# Altium project CC1200_PCB.PrjPcb
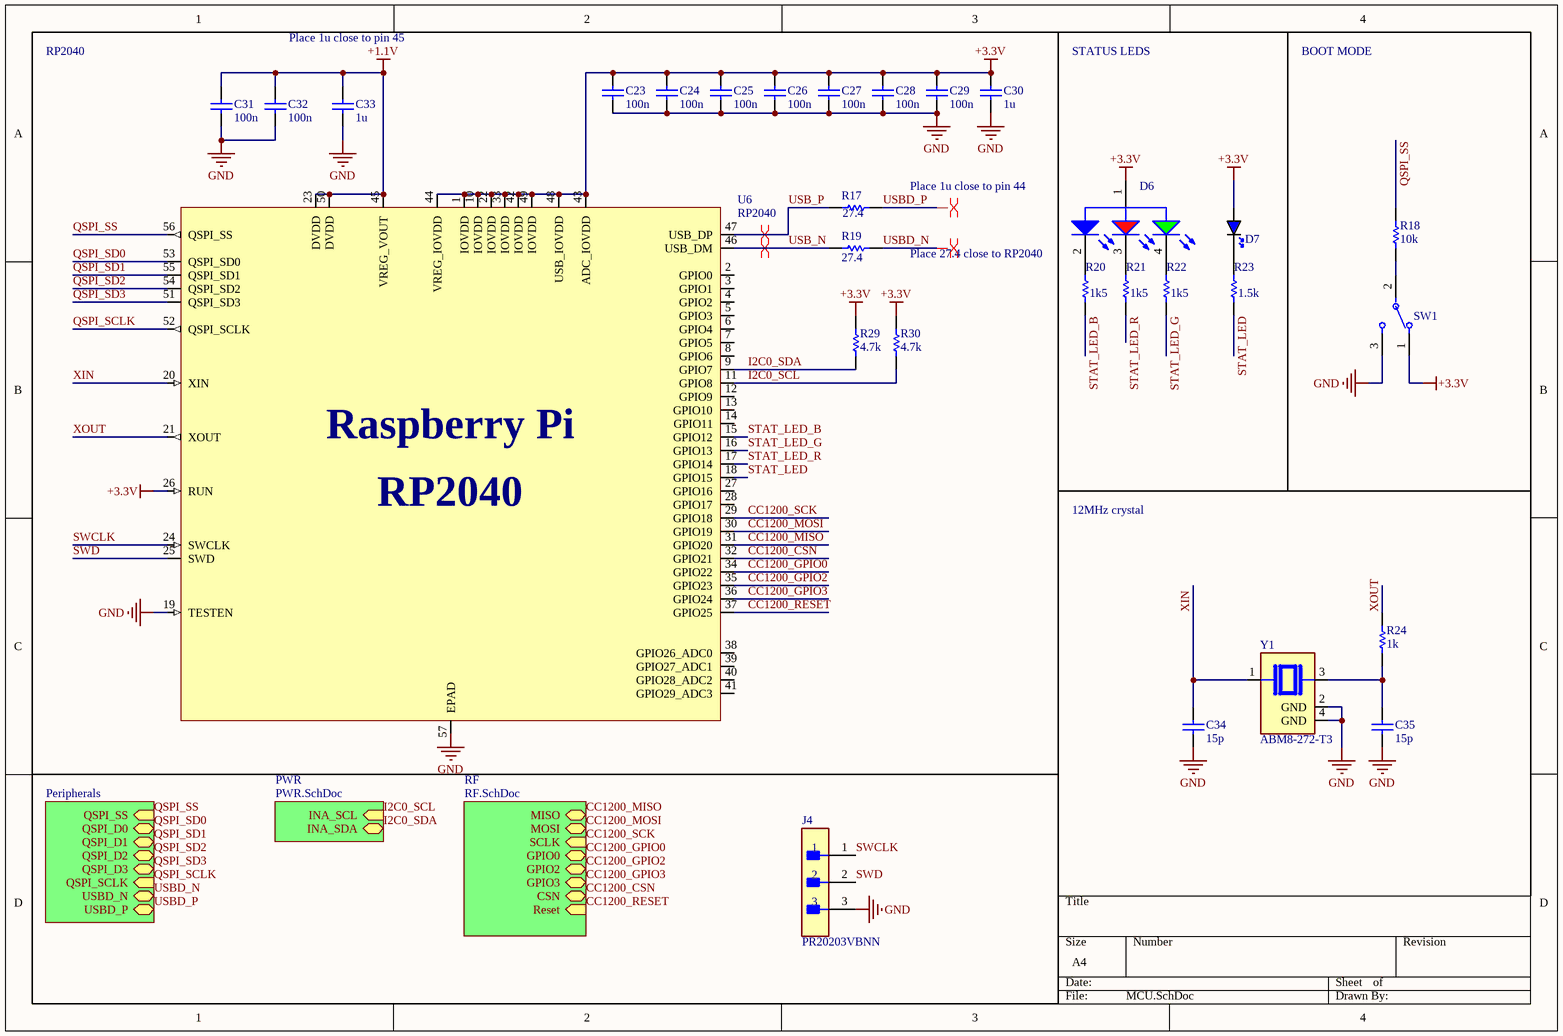
[diagram p0: MCU.SchDoc]
2 sheets, 69 parts. Net scope: hierarchical (ports join the sheet entries above them; power ports are global).
Board file: CC1200_PCB.PcbDoc
Sheets:
  MCU.SchDoc
    RF = RF.SchDoc

## Sheet MCU.SchDoc
size A4; SheetNumber: 1; SheetTotal: 4

### Parts
C23  value 100n  [RES_0805]  (hidden comment: Capacitor)
C24  value 100n  [RES_0805]  (hidden comment: Capacitor)
C25  value 100n  [RES_0805]  (hidden comment: Capacitor)
C26  value 100n  [RES_0805]  (hidden comment: Capacitor)
C27  value 100n  [RES_0805]  (hidden comment: Capacitor)
C28  value 100n  [RES_0805]  (hidden comment: Capacitor)
C29  value 100n  [RES_0805]  (hidden comment: Capacitor)
C30  value 1u  [RES_0805]  (hidden comment: Capacitor)
C31  value 100n  [RES_0805]  (hidden comment: Capacitor)
C32  value 100n  [RES_0805]  (hidden comment: Capacitor)
C33  value 1u  [RES_0805]  (hidden comment: Capacitor)
C34  value 15p  [RES_0805]  (hidden comment: Capacitor)
C35  value 15p  [RES_0805]  (hidden comment: Capacitor)
D6  150141M173100  [WL-SFTW_3528_150141M173100]  (value not drawn)
D7  BLUE  [LED_0805_BLUE]  (value not drawn)
J4  PR20203VBNN  [FP-PR20203VBNN-MFG]
R17  value 27.4  [RES_0805]  (hidden comment: Resistor)
R18  value 10k  [RES_0603]  (hidden comment: Resistor)
R19  value 27.4  [RES_0805]  (hidden comment: Resistor)
R20  value 1k5  [RES_0805]  (hidden comment: Resistor)
R21  value 1k5  [RES_0805]  (hidden comment: Resistor)
R22  value 1k5  [RES_0805]  (hidden comment: Resistor)
R23  value 1.5k  [RES_0805]  (hidden comment: Resistor)
R24  value 1k  [RES_0805]  (hidden comment: Resistor)
R29  value 4.7k  [RES_0805]  (hidden comment: Resistor)
R30  value 4.7k  [RES_0805]  (hidden comment: Resistor)
SW1  JS102011SAQN  [FP-JS102011SAQN-MFG]  (value not drawn)
U6  RP2040  [QFN-56-EP]
Y1  ABM8-272-T3  [XTAL_ABM8-272-T3]

### Sub-sheets
Peripherals = Peripherals.SchDoc (file not in this document): QSPI_SS (in), QSPI_D0 (bidir), QSPI_D1 (bidir), QSPI_D2 (bidir), QSPI_SCLK (in), QSPI_D3 (bidir), USBD_N (bidir), USBD_P (bidir)
PWR = PWR.SchDoc (file not in this document): INA_SCL (in), INA_SDA (bidir)
RF = RF.SchDoc: MISO (bidir), MOSI (bidir), SCLK (in), GPIO0 (bidir), GPIO2 (bidir), GPIO3 (bidir), CSN (bidir), Reset (in)

### Nets
+1.1V: C31.1 C32.1 C33.1 U6.23(DVDD) U6.45(VREG_VOUT) U6.50(DVDD)
+3.3V: C23.1 C24.1 C25.1 C26.1 C27.1 C28.1 C29.1 C30.1 D6.1(A) D7.A R29.2 R30.2 SW1.1 U6.1(IOVDD) U6.10(IOVDD) U6.22(IOVDD) U6.26(RUN) U6.33(IOVDD) U6.42(IOVDD) U6.43(ADC_IOVDD) U6.44(VREG_IOVDD) U6.48(USB_IOVDD) U6.49(IOVDD)
GND: C23.2 C24.2 C25.2 C26.2 C27.2 C28.2 C29.2 C30.2 C31.2 C32.2 C33.2 C34.2 C35.2 J4.3 SW1.3 U6.19(TESTEN) U6.57(EPAD) Y1.2(GND) Y1.4(GND)
CC1200_CSN: U6.32(GPIO21) ; sheet RF/CSN
CC1200_GPIO0: U6.34(GPIO22) ; sheet RF/GPIO0
CC1200_GPIO2: U6.35(GPIO23) ; sheet RF/GPIO2
CC1200_GPIO3: U6.36(GPIO24) ; sheet RF/GPIO3
CC1200_MISO: U6.31(GPIO20) ; sheet RF/MISO
CC1200_MOSI: U6.30(GPIO19) ; sheet RF/MOSI
CC1200_RESET: U6.37(GPIO25) ; sheet RF/Reset
CC1200_SCK: U6.29(GPIO18) ; sheet RF/SCLK
I2C0_SCL: R30.1 U6.11(GPIO8) ; sheet PWR/INA_SCL
I2C0_SDA: R29.1 U6.9(GPIO7) ; sheet PWR/INA_SDA
QSPI_SCLK: U6.52(QSPI_SCLK) ; sheet Peripherals/QSPI_SCLK
QSPI_SD0: U6.53(QSPI_SD0) ; sheet Peripherals/QSPI_D0
QSPI_SD1: U6.55(QSPI_SD1) ; sheet Peripherals/QSPI_D1
QSPI_SD2: U6.54(QSPI_SD2) ; sheet Peripherals/QSPI_D2
QSPI_SD3: U6.51(QSPI_SD3) ; sheet Peripherals/QSPI_D3
QSPI_SS: R18.1 U6.56(QSPI_SS) ; sheet Peripherals/QSPI_SS
STAT_LED: R23.2 U6.18(GPIO15)
STAT_LED_B: R20.2 U6.15(GPIO12)
STAT_LED_G: R22.2 U6.16(GPIO13)
STAT_LED_R: R21.2 U6.17(GPIO14)
SWCLK: J4.1 U6.24(SWCLK)
SWD: J4.2 U6.25(SWD)
USB_N: R19.1 U6.46(USB_DM)
USB_P: R17.1 U6.47(USB_DP)
USBD_N: R19.2 ; sheet Peripherals/USBD_N
USBD_P: R17.2 ; sheet Peripherals/USBD_P
XIN: C34.1 U6.20(XIN) Y1.1
XOUT: R24.2 U6.21(XOUT)
NetC35_1: C35.1 R24.1 Y1.3
NetD6_2: D6.2(K) R20.1
NetD6_3: D6.3(K) R21.1
NetD6_4: D6.4(K) R22.1
NetD7_K: D7.K R23.1
NetR18_2: R18.2 SW1.2(C)

Not connected (* = marked no-connect by the designer): U6 2(GPIO0) 3(GPIO1) 4(GPIO2) 5(GPIO3) 6(GPIO4) 7(GPIO5) 8(GPIO6) 12(GPIO9) 13(GPIO10) 14(GPIO11) 27(GPIO16) 28(GPIO17) 38(GPIO26_ADC0) 39(GPIO27_ADC1) 40(GPIO28_ADC2) 41(GPIO29_ADC3)

### Layout directives
differential pair: USB_N, USB_P, USBD_N, USBD_P

### Notes on the sheet
- Place 1u close to pin 45
- RP2040
- STATUS LEDS
- BOOT MODE
- Place 1u close to pin 44
- Place 27.4 close to RP2040
- 12MHz crystal

### Library data of the parts
C23-C35 = Capacitor: SimulationGenericComponent: True
D6 = CMP-1431-00001-2: NexarPartId: 29717795; Forward Current: 100mA; Peak Wavelength: 465nm; Viewing Angle: 120°; Color: Green, Red; Max Reverse Voltage (DC): 5V; Forward Voltage: 3.2V; Dominant Wavelength: 520nm; Test Current: 20mA; Power Dissipation: 72mW; Wavelength: 470nm; Lens Style: Clear, Round; Luminous Intensity: 230mcd; Case/Package: 1411; Packaging: Tape and Reel; Case Code (Metric): 3528; Min Operating Temperature: -40°C; Length: 3.5mm; Number of Pins: 4; Width: 2.8mm; Max Operating Temperature: 85°C; Case Code (Imperial): 1411; Height: 1.9mm; REACH SVHC: Unknown; Mount: Surface Mount; RoHS: Compliant
D7 = LED_0805_BLUE: LED 0805 BLUE SMD; Manufacturer: *; Manufacturer Part Number: *; Distributor Link: *; LCSC: *
J4 = CMP-77940-000002-1: CONN HEADER VERT 3POS 2.54MM; Manufacturer: Metz Connect; Conn Orientation: Straight; Current Rating: 3A; Number Of Contacts: 3; Conn Gender: Male; Temperature: -40°C to +105°C; Pitch: 2.54mm; Device Class L1: Connectors; Digikey Description: CONN HEADER VERT 3POS 2.54MM; ComponentLink2URL: https://datasheet.octopart.com/PR20203VBNN-Metz-Connect-datasheet-101610322.pdf; Height: 8.6mm; Temperature Range High: +105°C; Manufacturer Part Number: PR20203VBNN; Number Of Rows: 1; Octopart: https://octopart.com/pr20203vbnn-metz+connect-87667116; Device Class L3: unset; ComponentLink2Description: Datasheet; Device Class L2: Headers and Wire Housings; Temperature Range Low: -40°C; Automotive: No; Contact Material: Gold,Nickel; Category: Conn; Lead Free: Yes; RoHS: TRUE; Package: PR20203VBNN
R17-R24 R29 R30 = Resistor: TC1: 0; SimulationGenericComponent: True; TC2: 0
SW1 = CMP-2000-06501-2: SWITCH SLIDE SPDT 300MA 6V; Switch Function: On-On; Illumination Type: Non-Illuminated; Switch Travel: 2mm; Contact Resistance: 70mR; Actuator Material: Nylon; Electrical Life: 5000Cycles; Actuator Type: Standard; Max Operating Temperature: 85°C; Housing Material: Nylon; Radiation Hardening: No; Max Voltage Rating (DC): 6V; Package Quantity: 1; Case/Package: 100; Actuator Length: 2mm; Min Operating Temperature: -40°C; Contact Current Rating: 300mA; REACH SVHC: No SVHC; Throw Configuration: SPDT; Packaging: Tape and Reel; Contact Material: Copper Alloy; Max Current Rating: 300mA; Current Rating: 300mA; Mount: Surface Mount; Lead Free: Lead Free; Termination: Gull Wing; Voltage Rating (DC): 6V; Length: 9mm; Orientation: Right Angle; Contact Plating: Silver
U6 = RP2040: 32-Bit Dual-Core ARM Cortex-M0+ Microcontroller; Manufacturer: Raspberry Pi; Manufacturer Part Number: RP2040
Y1 = ABM8-272-T3: 12 MHz Â±30ppm Crystal 10pF 50 Ohms 4-SMD, No Lead; MF: ABRACON; SnapEDA_Link: https://www.snapeda.com/parts/ABM8-272-T3/Abracon/view-part/?ref=snap; Package: NON-STANDARD-4 Abracon; Value: *; MP: ABM8-272-T3; Check_prices: https://www.snapeda.com/parts/ABM8-272-T3/Abracon/view-part/?ref=eda

## Sheet RF.SchDoc
size A4; SheetNumber: 4; SheetTotal: 4
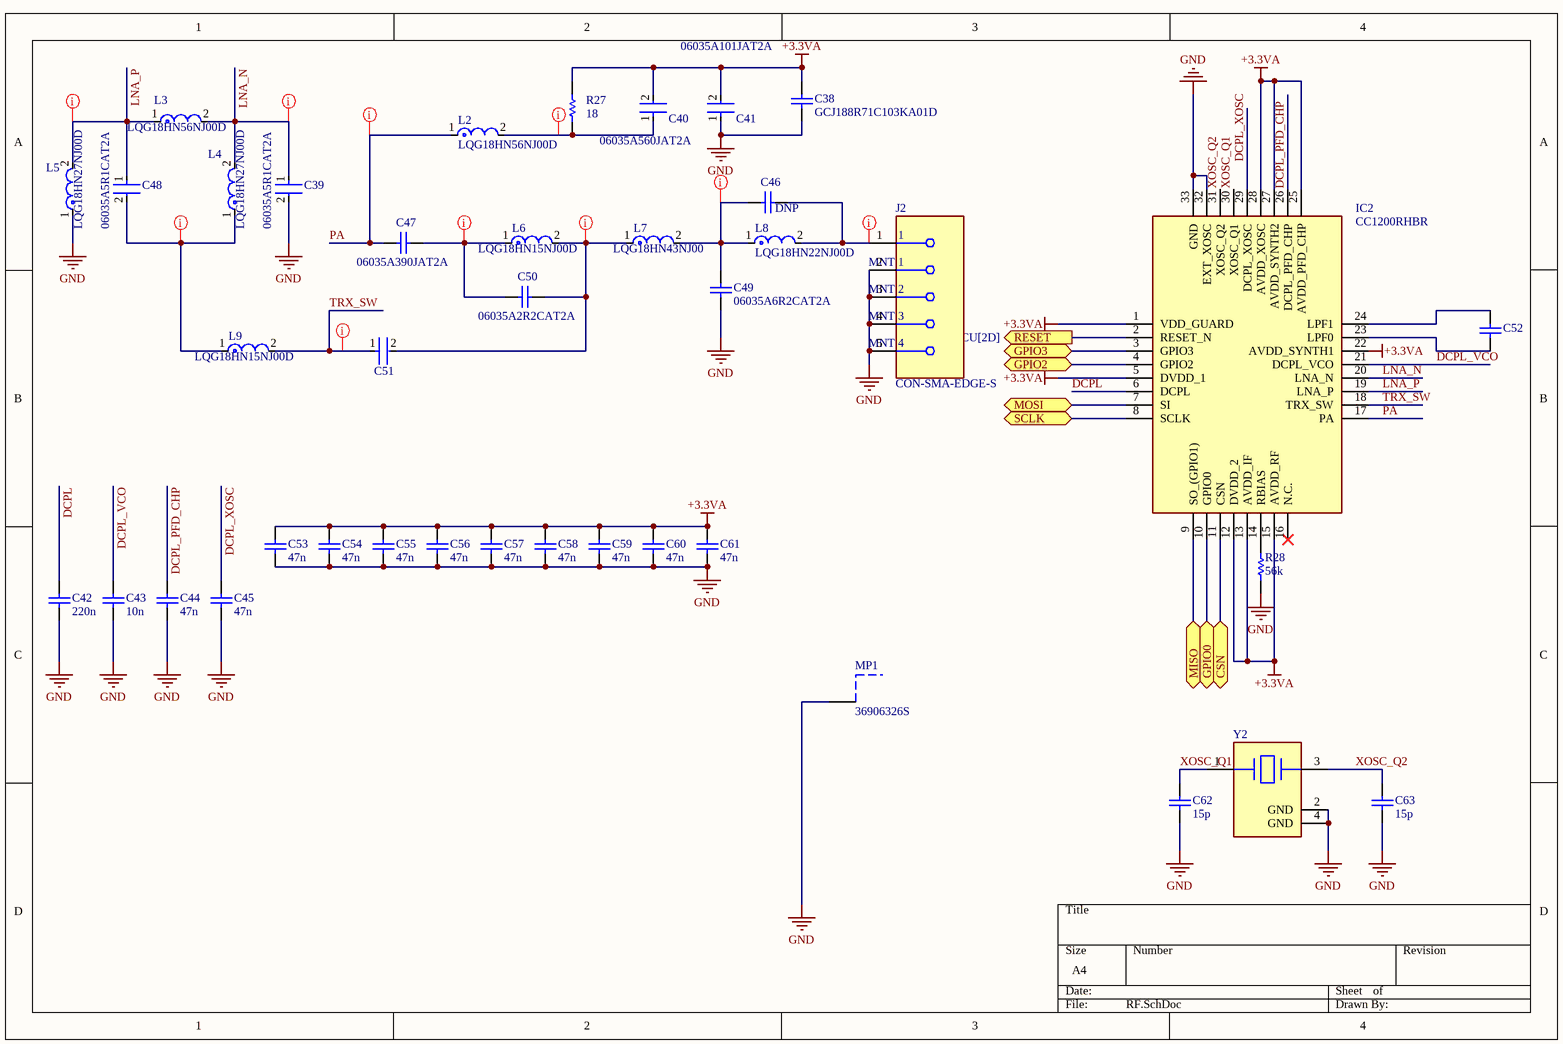
[diagram p1: RF.SchDoc]

### Parts
C38  GCJ188R71C103KA01D  [CAPC1608X90X35LL10T15]
C39  06035A5R1CAT2A  [FP-GCM188-0_1-IPC_A]
C40  06035A560JAT2A  [FP-GCM188-0_1-IPC_A]
C41  06035A101JAT2A  [FP-GCM188-0_1-IPC_A]
C42  value 220n  [RES_0805]  (hidden comment: Capacitor)
C43  value 10n  [RES_0805]  (hidden comment: Capacitor)
C44  value 47n  [RES_0805]  (hidden comment: Capacitor)
C45  value 47n  [RES_0805]  (hidden comment: Capacitor)
C46  DNP  [CAPC1608X90X35LL15T15]
C47  06035A390JAT2A  [CAPC1608X90X35LL15T15]
C48  06035A5R1CAT2A  [FP-GCM188-0_1-IPC_A]
C49  06035A6R2CAT2A  [CAPC1608X90X35LL15T15]
C50  06035A2R2CAT2A  [CAPC1608X90X35LL15T15]
C51  06035A5R1CAT2A  [FP-GCM188-0_1-IPC_A]  (value not drawn)
C52  GCM188R71H152KA37D  [CAPC1608X90X35LL10T15]  (value not drawn)
C53  value 47n  [RES_0805]  (hidden comment: Capacitor)
C54  value 47n  [RES_0805]  (hidden comment: Capacitor)
C55  value 47n  [RES_0805]  (hidden comment: Capacitor)
C56  value 47n  [RES_0805]  (hidden comment: Capacitor)
C57  value 47n  [RES_0805]  (hidden comment: Capacitor)
C58  value 47n  [RES_0805]  (hidden comment: Capacitor)
C59  value 47n  [RES_0805]  (hidden comment: Capacitor)
C60  value 47n  [RES_0805]  (hidden comment: Capacitor)
C61  value 47n  [RES_0805]  (hidden comment: Capacitor)
C62  value 15p  [RES_0805]  (hidden comment: Capacitor)
C63  value 15p  [RES_0805]  (hidden comment: Capacitor)
IC2  CC1200RHBR  [QFN50P500X500X100-33N-D]
J2  CON-SMA-EDGE-S  [FP-CON-SMA-EDGE-S-MFG]
L2  LQG18HN56NJ00D  [FP-LQG18HH_00-IPC_A]
L3  LQG18HN56NJ00D  [FP-LQG18HH_00-IPC_A]
L4  LQG18HN27NJ00D  [FP-LQG18HH_00-MFG]
L5  LQG18HN27NJ00D  [FP-LQG18HH_00-MFG]
L6  LQG18HN15NJ00D  [FP-LQG18HH_00-IPC_C]
L7  LQG18HN43NJ00  [FP-LQG18HH_00-IPC_C]
L8  LQG18HN22NJ00D  [FP-LQG18HH_00-IPC_C]
L9  LQG18HN15NJ00D  [FP-LQG18HH_00-IPC_C]
MP1  36906326S  [36906326S]
R27  value 18  [RES_0805]  (hidden comment: Resistor)
R28  value 56k  [RES_0805]  (hidden comment: Resistor)
Y2  NX3225SA-40.000MHZ-STD-CSR-1 NDK  [FP-ABM8G-MFG]  (value not drawn)

### Ports
CSN (bidir, see MCU[2D]), GPIO0 (bidir, see MCU[2D]), GPIO2 (bidir, see MCU[2D]), GPIO3 (bidir, see MCU[2D]), MISO (bidir, see MCU[2D]), MOSI (bidir, see MCU[2D]), RESET (out, see MCU[2D]), SCLK (bidir, see MCU[2D])

### Nets
+3.3VA: C38.2 C40.2 C41.2 C53.1 C54.1 C55.1 C56.1 C57.1 C58.1 C59.1 C60.1 C61.1 IC2.1(VDD_GUARD) IC2.5(DVDD_1) IC2.12(DVDD_2) IC2.13(AVDD_IF) IC2.15(AVDD_RF) IC2.22(AVDD_SYNTH1) IC2.25(AVDD_PFD_CHP) IC2.27(AVDD_SYNTH2) IC2.28(AVDD_XOSC) R27.1
GND: C38.1 C39.2 C41.1 C42.2 C43.2 C44.2 C45.2 C49.1 C53.2 C54.2 C55.2 C56.2 C57.2 C58.2 C59.2 C60.2 C61.2 C62.2 C63.2 IC2.32(EXT_XOSC) IC2.33(GND) J2.2(MNT_1) J2.3(MNT_2) J2.4(MNT_3) J2.5(MNT_4) L5.1 MP1.1 R28.2 Y2.2(GND) Y2.4(GND)
CC1200_CSN: IC2.11(CSN) ; port CSN
CC1200_GPIO0: IC2.10(GPIO0) ; port GPIO0
CC1200_GPIO2: IC2.4(GPIO2) ; port GPIO2
CC1200_GPIO3: IC2.3(GPIO3) ; port GPIO3
CC1200_MISO: IC2.9(SO_(GPIO1)) ; port MISO
CC1200_MOSI: IC2.7(SI) ; port MOSI
CC1200_RESET: IC2.2(RESET_N) ; port RESET
CC1200_SCK: IC2.8(SCLK) ; port SCLK
DCPL: C42.1 IC2.6(DCPL)
DCPL_PFD_CHP: C44.1 IC2.26(DCPL_PFD_CHP)
DCPL_VCO: C43.1 IC2.21(DCPL_VCO)
DCPL_XOSC: C45.1 IC2.29(DCPL_XOSC)
LNA_N: C39.1 IC2.20(LNA_N) L3.2 L4.2
LNA_P: C48.1 IC2.19(LNA_P) L3.1 L5.2
PA: C47.2 IC2.17(PA) L2.1
TRX_SW: C51.1 IC2.18(TRX_SW) L9.2
XOSC_Q1: C62.1 IC2.30(XOSC_Q1) Y2.1
XOSC_Q2: C63.1 IC2.31(XOSC_Q2) Y2.3
NetC40_1: C40.1 L2.2 R27.2
NetC46_1: C46.1 J2.1 L8.2
NetC46_2: C46.2 C49.2 L7.2 L8.1
NetC47_1: C47.1 C50.2 L6.1
NetC48_2: C48.2 L4.1 L9.1
NetC50_1: C50.1 C51.2 L6.2 L7.1
NetC52_1: C52.1 IC2.23(LPF0)
NetC52_2: C52.2 IC2.24(LPF1)
NetIC2_14: IC2.14(RBIAS) R28.1

Not connected (* = marked no-connect by the designer): IC2 16(N.C.)*

### Layout directives
net class 50ohm: LNA_N, LNA_P, NetC40_1, NetC46_1, NetC46_2, NetC47_1, NetC48_2, NetC50_1, PA, TRX_SW

### Library data of the parts
C38 = CMP-2000-06338-1: Cap Ceramic 0.01uF 16V X7R 10% Pad SMD 0603 Soft Termination 125C Automotive T/R; Manufacturer: Murata; Capacitance: 10nF; Mounting Technology: SurfaceMount; Tolerance (%): ±10%; Case Size/Dimension: 0603; Datasheet URL: http://search.murata.co.jp/Ceramy/image/img/A01X/G101/ENG/GRM188R71C103KA01-01.pdf; Rated Voltage: 16V; Datasheet Version: 02/2016; Dielectric: X7R; Manufacturer URL: http://www.murata.com/; Package Reference: 0603; Package Description: 2-Pin Surface Mount Device, Body 1.6 x 0.8 mm
C39 C48 C51 = CMP-06035-052280-1: 0603 5.1 pF 50 V ±0.25 pF Tolerance C0G/NP0 Multilayer Ceramic Capacitor
C40 = CMP-06035-052280-1: 0603 56 pF 50 V ±5% Tolerance C0G/NP0 Surface Mount Multilayer Ceramic Capacitor
C41 = CMP-06035-052280-1: 0603 100 pF 50 V ±5% Tolerance C0G/NP0 SMT Multilayer Ceramic Capacitor
C42-C45 C53-C63 = Capacitor: SimulationGenericComponent: True
C46 C47 = CMP-2006-04354-1: Part Number: 06035A6R2CAT2A; Manufacturer: AVX Interconnect / Elco
C49 = CMP-2006-04354-1: Manufacturer: AVX Interconnect / Elco; Part Number: 06035A6R2CAT2A
C50 = CMP-2006-04354-1: 0603 2.2 pF 50 V ±0.25 pF Tolerance C0G/NP0 SMT Multilayer Ceramic Capacitor; Part Number: 06035A6R2CAT2A; Manufacturer: AVX Interconnect / Elco
C52 = CMP-2006-02377-1: Manufacturer: Murata; Part Number: GCM188R71H152KA37D
IC2 = CC1200RHBR: Integrated Circuit; Manufacturer_Name: Texas Instruments; Datasheet Link: http://www.ti.com/lit/gpn/cc1200; Height: 1mm; Manufacturer_Part_Number: CC1200RHBR; Mouser Part Number: 595-CC1200RHBR; Mouser Price/Stock: https://www.mouser.co.uk/ProductDetail/Texas-Instruments/CC1200RHBR?qs=R6c3TimDHSkfQr3ZZbsbuA%3D%3D; Arrow Part Number: CC1200RHBR; Arrow Price/Stock: https://www.arrow.com/en/products/cc1200rhbr/texas-instruments
J2 = CMP-204357-000001-1: CONN SMA JACK STR EDGE MNT; Manufacturer: RF Solutions Ltd.; Impedance: 50Ω; Conn Orientation: Right Angle; Is Female: yes; Number Of Contacts: 1; Frequency: 18GHz; Shielding: true; Category: Conn; ComponentLink2URL: https://www.rfsolutions.co.uk/downloads/1498648656DS-CON-EDGE-SMA-4.pdf; Octopart: https://octopart.com/con-sma-edge-s-rf+solutions-70967450; Package: CONN_JACK; Manufacturer Part Number: CON-SMA-EDGE-S; Height: 6.35mm; Device Class L1: Connectors; Footprint Url: https://forum.upverter.com/uploads/default/original/3X/b/e/be75b907af57498775929d6d9099689c472e0307.pdf; Contact Material: Gold; ComponentLink2Description: Datasheet; Device Class L2: RF / Coaxial Connectors; RoHS: TRUE; Device Class L3: unset; Digikey Description: CONN SMA JACK STR EDGE MNT; Lead Free: Yes; Automotive: No
L2 L3 = CMP-06042-002204-1: Multilayer type RF Inductor 56nH ±5% 0.75Ω 400mA 0603; DC Current: 300mA; DC Resistance (DCR): 750mR; Self Resonant Frequency: 1.1GHz; Test Frequency: 100MHz; Shielding: Unshielded; Q Factor: 12; Core Material: Air; Width: 0.031inch; Case Code (Metric): 1608; Inductance: 56nH; Mount: Surface Mount; Depth: 0.95mm; Max DC Current: 300mA; Case/Package: 0603; Length: 1.75mm; Case Code (Imperial): 0603; Military Standard: Not; Min Operating Temperature: -40°C; Lead Free: Lead Free; Packaging: Tape and Reel; Radiation Hardening: No; Max Operating Temperature: 85°C; Termination: SMD/SMT; Tolerance: 5%; Current Rating: 300mA; Package Quantity: 1; Height: 0.031inch
L4 L5 = CMP-06042-005497-1: Multilayer type RF Inductor 27nH ±5% 0.54Ω 500mA 0603; Q Factor: 12; Shielding: Unshielded; Max DC Current: 300mA; Self Resonant Frequency: 2GHz; Test Frequency: 100MHz; Core Material: Air; DC Resistance (DCR): 550mR; Min Operating Temperature: -55°C; Max Operating Temperature: 85°C; Tolerance: 5%; Depth: 0.95mm; Case Code (Imperial): 0603; Package Quantity: 4000; Lead Free: Lead Free; Height: 0.8mm; Radiation Hardening: No; Case/Package: 0603; Mount: Surface Mount; DC Current: 300mA; Length: 0.063inch; Inductance Tolerance: 5%; Military Standard: Not; Termination: SMD/SMT; Packaging: Tape and Reel; Current Rating: 300mA; Inductance: 27nH; Case Code (Metric): 1608; Width: 0.8mm; REACH SVHC: No SVHC; Height - Seated (Max): 0.037inch
L6 L9 = CMP-06042-008636-1: Multilayer type RF Inductor 15nH ±5% 0.35Ω 600mA 0603; Q Factor: 12; Current Rating: 350mA; Core Material: Air; Shielding: Unshielded; Test Frequency: 100MHz; Self Resonant Frequency: 2.8GHz; DC Resistance (DCR): 400mR; Case Code (Imperial): 0603; Width: 0.031inch; Inductance: 15nH; REACH SVHC: No SVHC; Min Operating Temperature: -40°C; Mount: Surface Mount; Height: 0.031inch; Max Operating Temperature: 85°C; DC Current: 350mA; Lead Free: Lead Free; Depth: 0.95mm; Package Quantity: 4000; Radiation Hardening: No; Case Code (Metric): 1608; Termination: SMD/SMT; Inductance Tolerance: 5%; Military Standard: Not; Length: 0.063inch; Packaging: Tape and Reel; Case/Package: 0603; Max DC Current: 350mA; Tolerance: 5%
L7 = CMP-06042-008636-1: Multilayer type RF Inductor 43nH ±5%0603; Q Factor: 12; Current Rating: 350mA; Inductance: 15nH; Core Material: Air; Shielding: Unshielded; Test Frequency: 100MHz; Self Resonant Frequency: 2.8GHz; DC Resistance (DCR): 400mR; Inductance Tolerance: 5%; Case Code (Imperial): 0603; Width: 0.031inch; REACH SVHC: No SVHC; Min Operating Temperature: -40°C; Mount: Surface Mount; Height: 0.031inch; Max Operating Temperature: 85°C; DC Current: 350mA; Lead Free: Lead Free; Depth: 0.95mm; Package Quantity: 4000; Radiation Hardening: No; Case Code (Metric): 1608; Termination: SMD/SMT; Military Standard: Not; Length: 0.063inch; Packaging: Tape and Reel; Case/Package: 0603; Max DC Current: 350mA; Tolerance: 5%
L8 = CMP-06042-016460-1: Multilayer type RF Inductor 22nH ±5% 0.5Ω 500mA 0603; Current Rating: 300mA; Core Material: Air; Shielding: Unshielded; Self Resonant Frequency: 2.3GHz; Test Frequency: 100MHz; Q Factor: 12; DC Resistance (DCR): 500mR; Max Operating Temperature: 85°C; RoHS Compliant: Yes; Termination: SMD/SMT; Max DC Current: 300mA; Min Operating Temperature: -40°C; Height - Seated (Max): 0.037inch; Inductance: 22nH; Length: 1.6mm; REACH SVHC: No SVHC; Package Quantity: 4000; Tolerance: 5%; Depth: 0.95mm; Mount: Surface Mount; Packaging: Tape and Reel; Military Standard: Not; DC Current: 300mA; Case Code (Metric): 1608; Lead Free: Lead Free; Case Code (Imperial): 0603; Inductance Tolerance: 5%; Width: 0.031inch; Case/Package: 0603; Height: 0.8mm; Radiation Hardening: No; Series: LQG18H
MP1 = CMP-03913-78870950-1: 36906326S WE-SHC Shielding Cabinet; Core Material: Steel; Min Operating Temperature: -40°C; Length: 31.6mm; Height: 5.8mm; RoHS: Compliant; Max Operating Temperature: 125°C; NexarPartId: 78870950; Width: 31.6mm
R27 R28 = Resistor: TC1: 0; SimulationGenericComponent: True; TC2: 0
Y2 = CMP-27762-015223-1: Parallel - Fundamental Quartz Crystal, 40MHz Nom; ESR (Equivalent Series Resistance): 50R; Tolerance: 20ppm; Frequency Stability: 30ppm; Load Capacitance: 18pF; Radiation Hardening: No; Max Operating Temperature: 85°C; Termination: SMD/SMT; Height: 0.039inch; Packaging: Tape and Reel; Mount: Surface Mount; Min Operating Temperature: -40°C; Length: 3.2mm; Depth: 2.5mm; Series: ABM8G; Package Quantity: 1000; Width: 0.098inch; Series Resistance: 50R; Case/Package: CSMD; Frequency: 40MHz; Frequency Tolerance: 20ppm; Number of Pins: 4

## Nets that join several sheets
GND: MCU (19 pins), RF (30 pins)
CC1200_CSN: MCU (U6.32), RF (IC2.11)
CC1200_GPIO0: MCU (U6.34), RF (IC2.10)
CC1200_GPIO2: MCU (U6.35), RF (IC2.4)
CC1200_GPIO3: MCU (U6.36), RF (IC2.3)
CC1200_MISO: MCU (U6.31), RF (IC2.9)
CC1200_MOSI: MCU (U6.30), RF (IC2.7)
CC1200_RESET: MCU (U6.37), RF (IC2.2)
CC1200_SCK: MCU (U6.29), RF (IC2.8)